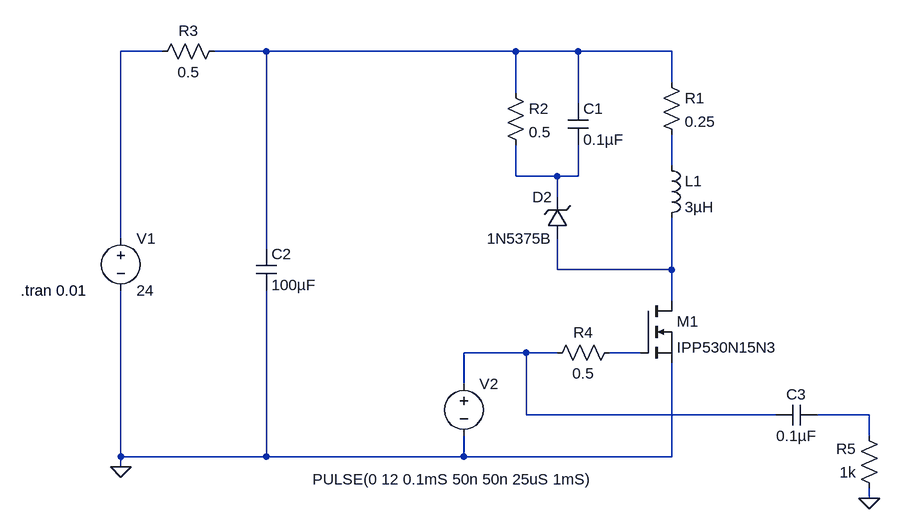
[diagram p0: schematic sparkgap.asc]
sparkgap.asc, the LTspice schematic file:
Version 4
SHEET 1 1000 680
WIRE -192 -240 -256 -240
WIRE -32 -240 -112 -240
WIRE 352 -240 -32 -240
WIRE 448 -240 352 -240
WIRE 592 -240 448 -240
WIRE 592 -192 592 -240
WIRE 352 -176 352 -240
WIRE 448 -160 448 -240
WIRE 592 -64 592 -112
WIRE 352 -48 352 -96
WIRE 416 -48 352 -48
WIRE 448 -48 448 -96
WIRE 448 -48 416 -48
WIRE 416 -16 416 -48
WIRE -256 48 -256 -240
WIRE -32 64 -32 -240
WIRE 416 96 416 48
WIRE 592 96 592 16
WIRE 592 96 416 96
WIRE 592 144 592 96
WIRE 368 224 272 224
WIRE 416 224 368 224
WIRE 544 224 496 224
WIRE 272 272 272 224
WIRE 368 320 368 224
WIRE 752 320 368 320
WIRE 896 320 816 320
WIRE 896 352 896 320
WIRE -256 384 -256 128
WIRE -32 384 -32 128
WIRE -32 384 -256 384
WIRE 272 384 272 352
WIRE 272 384 -32 384
WIRE 592 384 592 240
WIRE 592 384 272 384
WIRE -256 400 -256 384
WIRE 896 448 896 432
FLAG -256 400 0
FLAG 896 448 0
SYMBOL voltage -256 32 R0
WINDOW 123 0 0 Left 0
WINDOW 39 0 0 Left 0
SYMATTR InstName V1
SYMATTR Value 24
SYMBOL ind 576 -80 R0
SYMATTR InstName L1
SYMATTR Value 3µH
SYMATTR SpiceLine Rser=0.05
SYMBOL nmos 544 144 R0
SYMATTR InstName M1
SYMATTR Value IPP530N15N3
SYMBOL voltage 272 256 R0
WINDOW 3 -233 163 Left 2
WINDOW 123 0 0 Left 0
WINDOW 39 0 0 Left 0
SYMATTR InstName V2
SYMATTR Value PULSE(0 12 0.1mS 50n 50n 25uS 1mS)
SYMBOL zener 432 48 R180
WINDOW 0 24 64 Left 2
WINDOW 3 24 0 Left 2
SYMATTR InstName D2
SYMATTR Value 1N5375B
SYMATTR Description Diode
SYMATTR Type diode
SYMBOL res 336 -192 R0
SYMATTR InstName R2
SYMATTR Value 0.5
SYMBOL cap 432 -160 R0
SYMATTR InstName C1
SYMATTR Value 0.1µF
SYMBOL cap -48 64 R0
SYMATTR InstName C2
SYMATTR Value 100µF
SYMBOL res -96 -256 R90
WINDOW 0 0 56 VBottom 2
WINDOW 3 32 56 VTop 2
SYMATTR InstName R3
SYMATTR Value 0.5
SYMBOL res 576 -208 R0
SYMATTR InstName R1
SYMATTR Value 0.25
SYMBOL res 512 208 R90
WINDOW 0 0 56 VBottom 2
WINDOW 3 32 56 VTop 2
SYMATTR InstName R4
SYMATTR Value 0.5
SYMBOL res 912 448 R180
WINDOW 0 36 76 Left 2
WINDOW 3 36 40 Left 2
SYMATTR InstName R5
SYMATTR Value 1k
SYMBOL cap 816 304 R90
WINDOW 0 0 32 VBottom 2
WINDOW 3 32 32 VTop 2
SYMATTR InstName C3
SYMATTR Value 0.1µF
TEXT -410 128 Left 2 !.tran 0.01

The netlist it stands for:
* sparkgap.asc
V1 N001 0 24
L1 N003 N005 3µH Rser=0.05
M1 N005 N007 0 0 IPP530N15N3
V2 N006 0 PULSE(0 12 0.1mS 50n 50n 25uS 1mS)
D2 N005 N004 1N5375B
R2 N002 N004 0.5
C1 N002 N004 0.1µF
C2 N002 0 100µF
R3 N002 N001 0.5
R1 N002 N003 0.25
R4 N007 N006 0.5
R5 0 N008 1k
C3 N008 N006 0.1µF
.model D D
.lib standard.dio
.model NMOS NMOS
.model PMOS PMOS
.lib standard.mos
.tran 0.01
.backanno
.end